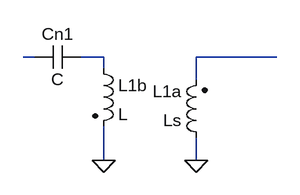
[diagram p0: schematic Draft4.asc]
Draft4.asc, the LTspice schematic file:
Version 4
SHEET 1 880 680
WIRE 80 64 64 64
WIRE 176 64 144 64
WIRE 416 64 304 64
WIRE 176 80 176 64
WIRE 304 96 304 64
WIRE 176 208 176 160
WIRE 304 208 304 176
FLAG 176 208 0
FLAG 304 208 0
SYMBOL ind2 320 192 R180
WINDOW 0 36 80 Left 2
WINDOW 3 36 40 Left 2
SYMATTR InstName L1a
SYMATTR Value Ls
SYMATTR Type ind
SYMBOL ind2 160 64 R0
SYMATTR InstName L1b
SYMATTR Type ind
SYMBOL cap 144 48 R90
WINDOW 0 0 32 VBottom 2
WINDOW 3 32 32 VTop 2
SYMATTR InstName Cn1

The netlist it stands for:
* Draft4.asc
L1a 0 N003 Ls
L1b N002 0 L
Cn1 N002 N001 C
.backanno
.end